# Altium schematic sheet 61200821621.SchDoc
size A; SheetNumber: 1; SheetTotal: 1
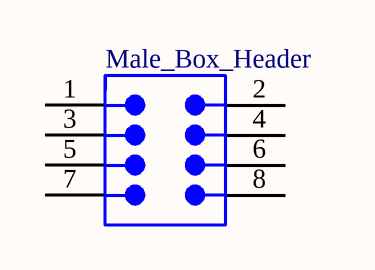
[diagram p0: 61200821621.SchDoc]

## Parts
Male_Box_Header  61200821621  [61200821621]  (value not drawn)

## Nets

Not connected (* = marked no-connect by the designer): Male_Box_Header 1 2 3 4 5 6 7 8

## Library data of the parts
Male_Box_Header = CMP-1502-00006-3: Wr-bhd; 2.54MM Pitch 8 Way 2 Row Shrouded Straight Pcb Header, Surface Mount; Number of Contacts: 8; Operating Supply Voltage: 250V; Gender: Male; Current Rating: 3A; Contact Resistance: 20mΩ; Connector Type: Male Pin; Insulation Resistance: 1GΩ; Pitch: 2.54mm; RoHS: Compliant; Row Spacing: 2.54mm; Color: Black; Termination: Solder; Min Operating Temperature: -40°C; Number of Rows: 2; Number of Positions: 8; Contact Material: Copper; Orientation: Vertical; Number of Pins: 8; Contact Plating: Gold; Insulation Material: PBT; Lead Pitch: 2.54mm; Length: 17.82mm; Max Operating Temperature: 105°C; Mount: Through Hole